# Altium schematic sheet Rx.SchDoc
size A; SheetNumber: 3; SheetTotal: 3
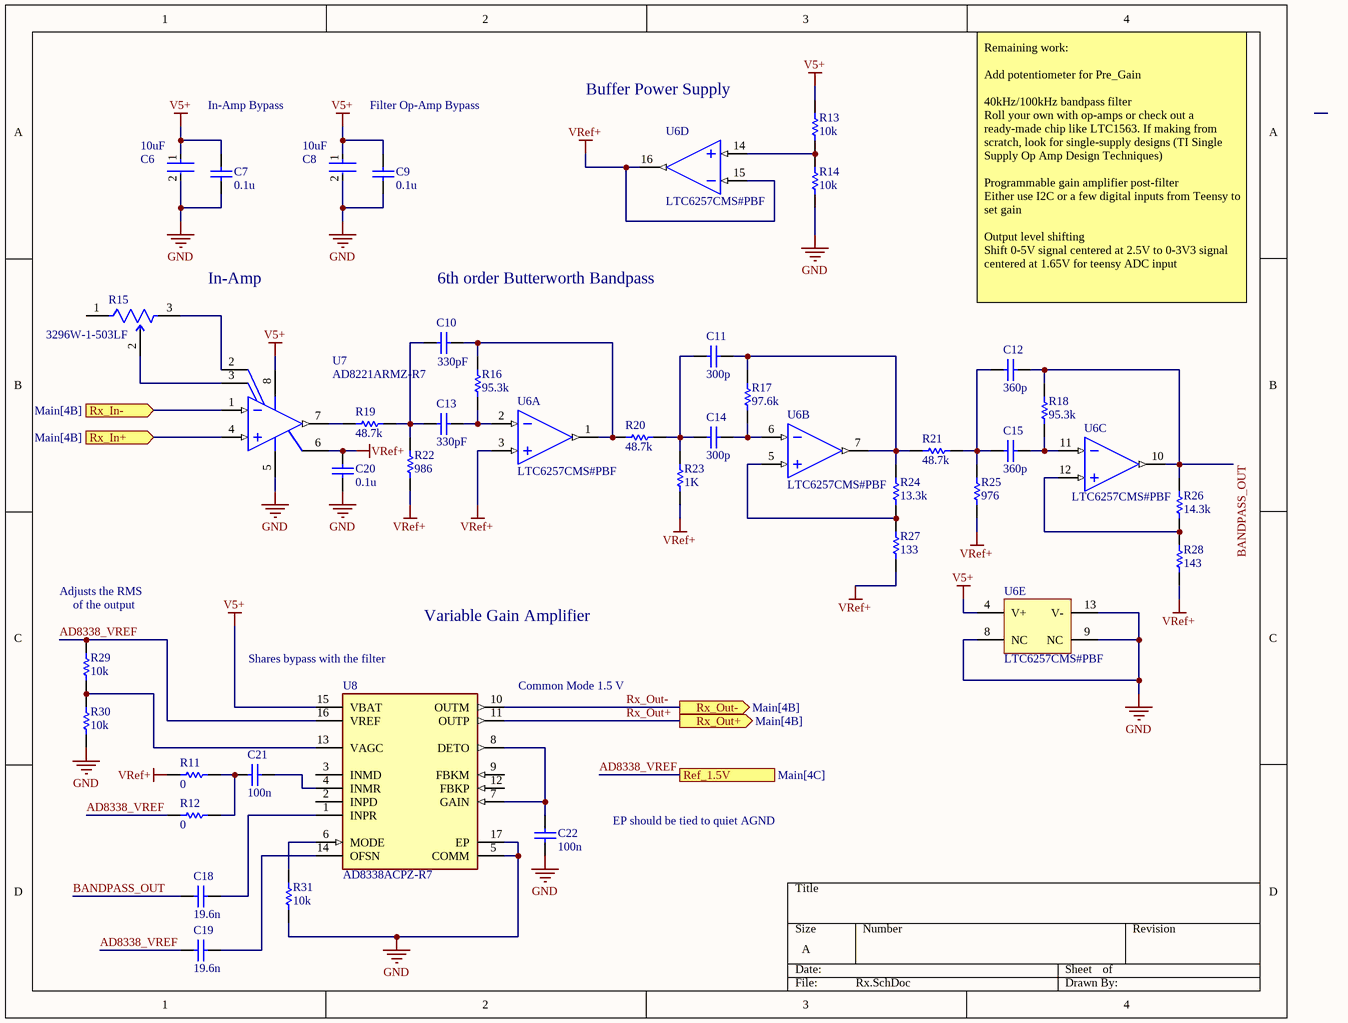
[diagram p0: Rx.SchDoc]

## Parts
C6  Capacitance: 10uF  [FP-C3216-160-0_2-IPC_A]  (hidden comment: C3216X5R1H106K160AB)
C7  value 0.1u  [0805]  (hidden comment: Capacitor)
C8  Capacitance: 10uF  [FP-C3216-160-0_2-IPC_A]  (hidden comment: C3216X5R1H106K160AB)
C9  value 0.1u  [0805]  (hidden comment: Capacitor)
C10  value 330pF  [0805]  (hidden comment: Capacitor)
C11  value 300p  [0805]  (hidden comment: Capacitor)
C12  value 360p  [0805]  (hidden comment: Capacitor)
C13  value 330pF  [0805]  (hidden comment: Capacitor)
C14  value 300p  [0805]  (hidden comment: Capacitor)
C15  value 360p  [0805]  (hidden comment: Capacitor)
C18  value 19.6n  [0805]  (hidden comment: Capacitor)
C19  value 19.6n  [0805]  (hidden comment: Capacitor)
C20  value 0.1u  [0805]  (hidden comment: Capacitor)
C21  value 100n  [0805]  (hidden comment: Capacitor)
C22  value 100n  [0805]  (hidden comment: Capacitor)
R11  value 0  [0805]  (hidden comment: Resistor)
R12  value 0  [0805]  (hidden comment: Resistor)
R13  value 10k  [0805]  (hidden comment: Resistor)
R14  value 10k  [0805]  (hidden comment: Resistor)
R15  3296W-1-503LF  [FP-3296W-MFG]
R16  value 95.3k  [0805]  (hidden comment: Resistor)
R17  value 97.6k  [0805]  (hidden comment: Resistor)
R18  value 95.3k  [0805]  (hidden comment: Resistor)
R19  value 48.7k  [0805]  (hidden comment: Resistor)
R20  value 48.7k  [0805]  (hidden comment: Resistor)
R21  value 48.7k  [0805]  (hidden comment: Resistor)
R22  value 986  [0805]  (hidden comment: Resistor)
R23  value 1K  [0805]  (hidden comment: Resistor)
R24  value 13.3k  [0805]  (hidden comment: Resistor)
R25  value 976  [0805]  (hidden comment: Resistor)
R26  value 14.3k  [0805]  (hidden comment: Resistor)
R27  value 133  [0805]  (hidden comment: Resistor)
R28  value 143  [0805]  (hidden comment: Resistor)
R29  value 10k  [0805]  (hidden comment: Resistor)
R30  value 10k  [0805]  (hidden comment: Resistor)
R31  value 10k  [0805]  (hidden comment: Resistor)
U6  LTC6257CMS#PBF  [LT-MS-16_N]  (parts A,B,C,D,E of 5)
U7  AD8221ARMZ-R7  [ADI-RM-8_L]
U8  AD8338ACPZ-R7  [FP-CP-16-22-IPC_C]

## Ports
Ref_1.5V (see Main[4C]), Rx_In+ (in, see Main[4B]), Rx_In- (in, see Main[4B]), Rx_Out+ (out, see Main[4B]), Rx_Out- (out, see Main[4B])

## Nets
GND: C6.2 C7.1 C8.2 C9.1 C20.1 C22.1 R14.1 R30.1 R31.1 U6.8(NC) U6.9(NC) U6.13(V-) U7.5(VS-) U8.5(COMM) U8.17(EP)
V5+: C6.1 C7.2 C8.1 C9.2 R13.2 U6.4(V+) U7.8(VS+) U8.15(VBAT)
VRef+: C20.2 R11.2 R22.1 R23.1 R25.1 R27.1 R28.1 U6.3(IN+_A) U6.15(IN-_D) U6.16(OUT_D) U7.6(REF)
AD8338_VREF: C19.2 R12.2 R29.2 U8.16(VREF) ; port Ref_1.5V
BANDPASS_OUT: C12.1 C18.2 R18.2 R26.2 U6.10(OUT_C)
Rx_In+: U7.4(IN+) ; port Rx_In+
Rx_In-: U7.1(IN-) ; port Rx_In-
Rx_Out+: U8.11(OUTP) ; port Rx_Out+
Rx_Out-: U8.10(OUTM) ; port Rx_Out-
NetC10_1: C10.1 R16.2 R20.1 U6.1(OUT_A)
NetC10_2: C10.2 C13.2 R19.2 R22.2
NetC11_1: C11.1 R17.2 R21.1 R24.2 U6.7(OUT_B)
NetC11_2: C11.2 C14.2 R20.2 R23.2
NetC12_2: C12.2 C15.2 R21.2 R25.2
NetC13_1: C13.1 R16.1 U6.2(IN-_A)
NetC14_1: C14.1 R17.1 U6.6(IN-_B)
NetC15_1: C15.1 R18.1 U6.11(IN-_C)
NetC18_1: C18.1 U8.1(INPR)
NetC19_1: C19.1 U8.14(OFSN)
NetC21_1: C21.1 U8.4(INMR)
NetC21_2: C21.2 R11.1 R12.1
NetC22_2: C22.2 U8.7(GAIN) U8.8(DETO)
NetR13_1: R13.1 R14.2 U6.14(IN+_D)
NetR15_2: R15.2(WIPER) U7.3(RG)
NetR15_3: R15.3(CW) U7.2(RG)
NetR19_1: R19.1 U7.7(VOUT)
NetR24_1: R24.1 R27.2 U6.5(IN+_B)
NetR26_1: R26.1 R28.2 U6.12(IN+_C)
NetR29_1: R29.1 R30.2 U8.13(VAGC)
NetR31_2: R31.2 U8.6(MODE)

Not connected (* = marked no-connect by the designer): R15 1(CCW); U8 2(INPD) 3(INMD) 9(FBKM) 12(FBKP)

## Notes on the sheet
- Buffer Power Supply
- In-Amp Bypass
- Filter Op-Amp Bypass
- In-Amp
- 6th order Butterworth Bandpass
- Remaining work:
  Add potentiometer for Pre_Gain
  40kHz/100kHz bandpass filter
  Roll your own with op-amps or check out a ready-made chip like LTC1563. If making from scratch, look for single-supply designs (TI Single Supply Op Amp Design Techniques)
  Programmable gain amplifier post-filter
  Either use I2C or a few digital inputs from Teensy to set gain
  Output level shifting
  Shift 0-5V signal centered at 2.5V to 0-3V3 signal centered at 1.65V for teensy ADC input
- Adjusts the RMS
- (near R29) of the output
- Variable Gain Amplifier
- (near U8) Shares bypass with the filter
- (near U8) Common Mode 1.5 V
- EP should be tied to quiet AGND

## Library data of the parts
C6 C8 = CMP-2000-06045-2: Multilayer Ceramic Capacitors 10uF ±10% 50V X5R SMD 1206; Min Operating Temperature: -55°C; Weight: 0.000571oz; Tolerance: 10%; Lead Free: Lead Free; REACH SVHC: No SVHC; Dielectric Material: Ceramic; Termination: SMD/SMT; Radiation Hardening: No; Case Code (Metric): 3216; Max Operating Temperature: 85°C; Voltage Rating (DC): 50V; Packaging: Tape and Reel; Height: 1.6mm; Voltage: 50V; Dielectric: X5R; Mount: Surface Mount; Voltage Rating: 50V; Length: 3.2mm; RoHS Compliant: Yes; Thickness: 0.071inch; Depth: 1.6mm; Width: 0.063inch; Case/Package: 1206; Series: C; Package Quantity: 1; Resistor Type: Ceramic; Case Code (Imperial): 1206; Construction: Flat
C7 C9-C15 C18-C22 = Capacitor: SimulationGenericComponent: True
R11 R12 = Resistor: SimulationGenericComponent: True; TC1: 0; TC2: 0
R13 R14 R16-R18 R21-R31 = Resistor: TC1: 0; SimulationGenericComponent: True; TC2: 0
R15 = CMP-07234-000043-1: TRIMMER 50K OHM 0.5W PC PIN TOP; Manufacturer Series: 3296; Resistance Tolerance: 10%; Actuator Orientation: Vertical; Resistance: 50kR; Number of Turns: 25; Power Rating: 500mW; Insulation Resistance: 1GR; Actuator Type: SCREW; Resistance Law: Linear; Number of Terminals/Pins: 3; Temperature Coefficient: 100ppm/°C; Weight: 0.03oz; Length: 9.53mm; Package Quantity: 50; Resistor Type: Cermet; Min Operating Temperature: -55°C; Termination: Pin; Radiation Hardening: No; Terminal Finish: Tin; Height: 0.395inch; Depth: 4.83mm; REACH SVHC: No SVHC; Width: 9.53mm; Packaging: Rail/Tube; RoHS Compliant: Yes; Mount: Panel; Max Power Dissipation: 500mW; Taper: Linear; Color: Blue; Technology: CERMET; Lead Free: Lead Free; Max Operating Temperature: 125°C; Number of Pins: 3; Type: Potentiometer; Military Standard: Not; Contact Plating: Tin; Series: 3296; Tolerance: 10%
R19 R20 = Resistor: Fixed Resistor, Metal Glaze/thick Film, 0.125W, 48700ohm, 150V, 1% +/-Tol, 100ppm/Cel, Surface Mount, 0805; Manufacturer: Panasonic; Manufacturer Part Number: ERJ-6ENF4872V; TC1: 0; SimulationGenericComponent: True; Power: 125mW; Temperature Coefficient: 100ppm/°C; Rated Temperature: 70°C; Package Height: 0.6mm; Package Length: 2mm; Package Width: 1.25mm; Reference Standard: AEC-Q200; TC2: 0; Supplier: Mouser; Supplier Part Number: 667-ERJ-6ENF4872V; RoHS: Yes; Category: Chip SMD Resistors; Stock: 62583; Pricing: 1=0.11000, 10=0.08900, 50=0.08900, 100=0.03500, 1000=0.01600, 10000=0.01100 (USD); Mounting Technology: Surface Mount; Pins: 2; Case/Package: 0805; Terminal Finish: Nickel; Package Shape: Rectangular; Min Operating Temperature: -55°C; Max Operating Temperature: 155°C; Tolerance: 1%; Resistor Type: FIXED RESISTOR; Packaging: Tape and Reel; Technology: METAL GLAZE/THICK FILM; Termination: Wraparound; Working Voltage: 150V; Construction: Rectangular; Package Style: SMTMeter; JESD-609 Code: e3; RoHS Compliant: Yes; Reach SVHC Compliant: Yes; ComponentLink1URL: https://datasheet.ciiva.com:443/pdfs/VipMasterIC/IC/PANA/PANA-S-A0009889626/PANA-S-A0009889626-1.pdf?src-supplier=IHS+Markit; ComponentLink1Description: https://datasheet.ciiva.com:443/pdfs/VipMasterIC/IC/PANA/PANA-S-A0009889626/PANA-S-A0009889626-1.pdf?src-supplier=IHS+Markit; ComponentLink2URL: https://datasheet.ciiva.com/9189/aoa0000ce2-9189241.pdf?src-supplier=Avnet; ComponentLink2Description: https://datasheet.ciiva.com/9189/aoa0000ce2-9189241.pdf?src-supplier=Avnet; ComponentLink3URL: https://datasheet.ciiva.com/46420/1678782-46420077.pdf?src-supplier=Element14; ComponentLink3Description: https://datasheet.ciiva.com/46420/1678782-46420077.pdf?src-supplier=Element14; ComponentLink4URL: https://datasheet.ciiva.com/22668/1678782-22668698.pdf?src-supplier=Element14; ComponentLink4Description: https://datasheet.ciiva.com/22668/1678782-22668698.pdf?src-supplier=Element14; ComponentLink5URL: https://datasheet.ciiva.com/24063/aoa0000ce2-24063086.pdf?src-supplier=Mouser; ComponentLink5Description: https://datasheet.ciiva.com/24063/aoa0000ce2-24063086.pdf?src-supplier=Mouser
U6 = CMP-0359-00487-2: Quad Channel, Power Efficient Operational Amplifier, RRIO, 6.5 MHz Typical GBW, 1.8 V/us Typical SR, 1.8 to 5.25 V, 16-Pin SOP (MS16), Commercial, Pb-Free; Manufacturer: Linear Technology; Manufacturer Part Number: ERJ-6ENF4872V; Vs Max (V): 5.25; GBW (MHz) Typical: 6.5; Is (mA) Typical: 0.065; SR (V/us) Typical: 1.8; Vos (mV) Typical: 0.1; Channels (#): 4; Description: Fixed Resistor, Metal Glaze/thick Film, 0.125W, 48700ohm, 150V, 1% +/-Tol, 100ppm/Cel, Surface Mount, 0805; Tolerance: 1%; Power: 125mW; Value: 48.7kR; Temperature Coefficient: 100ppm/°C; Working Voltage: 150V; Rated Temperature: 70°C; Package Height: 0.6mm; Package Length: 2mm; Package Width: 1.25mm; Reference Standard: AEC-Q200; ComponentLink3URL: http://cds.linear.com/docs/en/packaging/MSOP_16_05-08-1669.pdf; PackageReference: LT-MS-16; ComponentLink2Description: Datasheet; PackageDescription: 16-Lead Plastic MSOP, Body 4.04 x 3.00 mm, Pitch 0.50 mm; Type: VFB; ComponentLink3Description: Package Specification; Mounting Technology: Surface Mount; ComponentLink1URL: http://www.linear.com/; DatasheetVersion: Rev. B; PartNumber: LTC6257CMS#PBF; RoHS: Pb-Free; Linear Technology Part Number: LTC6257; PackageVersion: Rev Ã˜; Vs Min (V): 1.8; ComponentLink2URL: http://cds.linear.com/docs/en/datasheet/625567fb.pdf; ComponentLink1Description: Manufacturer URL; RevisionNote: URLs updated; Supplier: Mouser; Supplier Part Number: 667-ERJ-6ENF4872V; Category: Chip SMD Resistors; Stock: 62583; Pricing: 1=0.11000, 10=0.08900, 50=0.08900, 100=0.03500, 1000=0.01600, 10000=0.01100 (USD); Pins: 2; Case/Package: 0805; Terminal Finish: Nickel; Package Shape: Rectangular; Min Operating Temperature: -55°C; Max Operating Temperature: 155°C; Resistor Type: FIXED RESISTOR; Packaging: Tape and Reel; Technology: METAL GLAZE/THICK FILM; Termination: Wraparound; Construction: Rectangular; Package Style: SMTMeter; JESD-609 Code: e3; RoHS Compliant: Yes; Reach SVHC Compliant: Yes; ComponentLink4URL: https://datasheet.ciiva.com:443/pdfs/VipMasterIC/IC/PANA/PANA-S-A0009889626/PANA-S-A0009889626-1.pdf?src-supplier=IHS+Markit; ComponentLink4Description: https://datasheet.ciiva.com:443/pdfs/VipMasterIC/IC/PANA/PANA-S-A0009889626/PANA-S-A0009889626-1.pdf?src-supplier=IHS+Markit; ComponentLink5URL: https://datasheet.ciiva.com/9189/aoa0000ce2-9189241.pdf?src-supplier=Avnet; ComponentLink5Description: https://datasheet.ciiva.com/9189/aoa0000ce2-9189241.pdf?src-supplier=Avnet; ComponentLink6URL: https://datasheet.ciiva.com/46420/1678782-46420077.pdf?src-supplier=Element14; ComponentLink6Description: https://datasheet.ciiva.com/46420/1678782-46420077.pdf?src-supplier=Element14; ComponentLink7URL: https://datasheet.ciiva.com/22668/1678782-22668698.pdf?src-supplier=Element14; ComponentLink7Description: https://datasheet.ciiva.com/22668/1678782-22668698.pdf?src-supplier=Element14; ComponentLink8URL: https://datasheet.ciiva.com/24063/aoa0000ce2-24063086.pdf?src-supplier=Mouser; ComponentLink8Description: https://datasheet.ciiva.com/24063/aoa0000ce2-24063086.pdf?src-supplier=Mouser
U7 = CMP-0934-00067-1: Precision Instrumentation Amplifier, 2 V/us, -40 to 125 degC, 8-Pin MSOP (RM-8), RoHS, Tape and Reel; Manufacturer: Analog Devices; -3dB Bandwidth@G: 1=825 kHz; VIO: 60 uV Max.; Quiescent Current: 0.9 mA Typ.; Slew Rate@G: 1=2 V/us Typ.; PartNumber: AD8221ARMZ-R7; ComponentLink3Description: Package Specification; Packing: Tape and Reel; PackageVersion: Aug-05; Temperature Range: -40 to 125 degC; RoHS: TRUE; ComponentLink3URL: http://www.analog.com/static/imported-files/packages/PKG_PDF/MSOP(RM)/RM_8.pdf; PackageDescription: 8-Pin Mini Small Outline Package, Body 3 x 3 mm, Pitch 0.65 mm; ComponentLink1URL: http://www.analog.com/en/index.html; ComponentLink2URL: http://www.analog.com/static/imported-files/data_sheets/AD8221.pdf; ComponentLink2Description: Datasheet; ComponentLink1Description: Manufacturer URL; DatasheetVersion: Rev. C; Mounting Technology: Surface Mount
U8 = CMP-09116-000032-1: IC OPAMP VGA 1 CIRCUIT 16LFCSP; Manufacturer: Analog Devices; Nominal Supply Current: 3-6mA; Max Supply Voltage: 5V; Number Of Channels: 1; Output Current Per Channel: 5mA; Max Junction Temp: +150°C; Min Supply Voltage: 3V; Bandwidth: 18MHz; Voltage Gain: 80dB; Description: Fixed Resistor, Metal Glaze/thick Film, 0.125W, 48700ohm, 150V, 1% +/-Tol, 100ppm/Cel, Surface Mount, 0805; Tolerance: 1%; Power: 125mW; Value: 48.7kR; Temperature Coefficient: 100ppm/°C; Working Voltage: 150V; Rated Temperature: 70°C; Package Height: 0.6mm; Package Length: 2mm; Package Width: 1.25mm; Reference Standard: AEC-Q200; Mouser Description: Special Purpose Amplifiers Ultra Low Pwr 18MHz SGL CH VGA; Device Class L2: Linear ICs; Ipc Land Pattern Name: QFN50P300X300X75-16; Temperature Range Low: -40°C; Device Class L1: Integrated Circuits (ICs); RoHS: TRUE; Digikey Description: IC OPAMP VGA 1 CIRCUIT 16LFCSP; Category: IC; ComponentLink2URL: https://www.analog.com/media/en/technical-documentation/data-sheets/AD8338.pdf; Automotive: No; Height: 0.8mm; Manufacturer Part Number: AD8338ACPZ-R7; Octopart: https://octopart.com/ad8338acpz-r7-analog+devices-21054770; Temperature: -40°C to +85°C; ComponentLink2Description: Datasheet; Lead Free: Yes; Temperature Range High: +85°C; Package: CP-16-22; Device Class L3: Amplifiers - Op Amps; Supplier: Mouser; Supplier Part Number: 667-ERJ-6ENF4872V; Stock: 62583; Pricing: 1=0.11000, 10=0.08900, 50=0.08900, 100=0.03500, 1000=0.01600, 10000=0.01100 (USD); Mounting Technology: Surface Mount; Pins: 2; Case/Package: 0805; Terminal Finish: Nickel; Package Shape: Rectangular; Min Operating Temperature: -55°C; Max Operating Temperature: 155°C; Resistor Type: FIXED RESISTOR; Packaging: Tape and Reel; Technology: METAL GLAZE/THICK FILM; Termination: Wraparound; Construction: Rectangular; Package Style: SMTMeter; JESD-609 Code: e3; RoHS Compliant: Yes; Reach SVHC Compliant: Yes; ComponentLink1URL: https://datasheet.ciiva.com:443/pdfs/VipMasterIC/IC/PANA/PANA-S-A0009889626/PANA-S-A0009889626-1.pdf?src-supplier=IHS+Markit; ComponentLink1Description: https://datasheet.ciiva.com:443/pdfs/VipMasterIC/IC/PANA/PANA-S-A0009889626/PANA-S-A0009889626-1.pdf?src-supplier=IHS+Markit; ComponentLink3URL: https://datasheet.ciiva.com/9189/aoa0000ce2-9189241.pdf?src-supplier=Avnet; ComponentLink3Description: https://datasheet.ciiva.com/9189/aoa0000ce2-9189241.pdf?src-supplier=Avnet; ComponentLink4URL: https://datasheet.ciiva.com/46420/1678782-46420077.pdf?src-supplier=Element14; ComponentLink4Description: https://datasheet.ciiva.com/46420/1678782-46420077.pdf?src-supplier=Element14; ComponentLink5URL: https://datasheet.ciiva.com/22668/1678782-22668698.pdf?src-supplier=Element14; ComponentLink5Description: https://datasheet.ciiva.com/22668/1678782-22668698.pdf?src-supplier=Element14; ComponentLink6URL: https://datasheet.ciiva.com/24063/aoa0000ce2-24063086.pdf?src-supplier=Mouser; ComponentLink6Description: https://datasheet.ciiva.com/24063/aoa0000ce2-24063086.pdf?src-supplier=Mouser